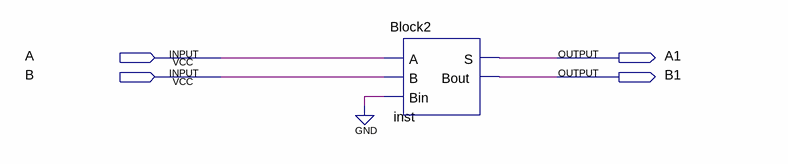
[diagram p0: schematic sheet]
// Quartus schematic aula7.bdf as structural Verilog: 1 symbols, 4 pins
module aula7 (
  input  A,
  input  B,
  output A1,
  output B1
);

  Block2 inst (.A(A), .B(B), .Bin(1'b0), .S(A1), .Bout(B1));
endmodule
